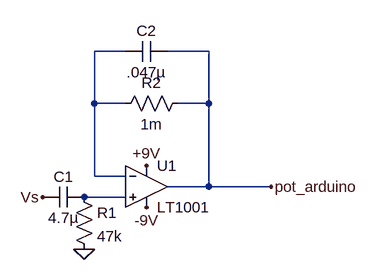
[diagram p0: schematic hrm_tcrt_v1.asc]
hrm_tcrt_v1.asc, the LTspice schematic file:
Version 4
SHEET 1 880 680
WIRE 160 -16 112 -16
WIRE 288 -16 224 -16
WIRE 112 64 112 -16
WIRE 160 64 112 64
WIRE 288 64 288 -16
WIRE 288 64 240 64
WIRE 112 176 112 64
WIRE 160 176 112 176
WIRE 288 192 288 64
WIRE 288 192 224 192
WIRE 384 192 288 192
WIRE 160 208 96 208
FLAG 192 160 +9V
FLAG 192 224 -9V
FLAG 96 288 0
FLAG 32 208 Vs
FLAG 384 192 pot_arduino
SYMBOL Opamps\\LT1001 192 128 R0
SYMATTR InstName U1
SYMBOL cap 96 192 R90
WINDOW 0 0 32 VBottom 2
WINDOW 3 32 32 VTop 2
SYMATTR InstName C1
SYMATTR Value 4.7µ
SYMBOL res 80 192 R0
SYMATTR InstName R1
SYMATTR Value 47k
SYMBOL res 256 48 R90
WINDOW 0 0 56 VBottom 2
WINDOW 3 32 56 VTop 2
SYMATTR InstName R2
SYMATTR Value 1m
SYMBOL cap 224 -32 R90
WINDOW 0 0 32 VBottom 2
WINDOW 3 32 32 VTop 2
SYMATTR InstName C2
SYMATTR Value .047µ

The netlist it stands for:
* hrm_tcrt_v1.asc
XU1 N002 N001 +9V -9V pot_arduino LT1001  ; pins In+ In- V+ V- OUT
C1 N002 Vs 4.7µ
R1 N002 0 47k
R2 pot_arduino N001 1m
C2 pot_arduino N001 .047µ
.lib LTC.lib
.backanno
.end